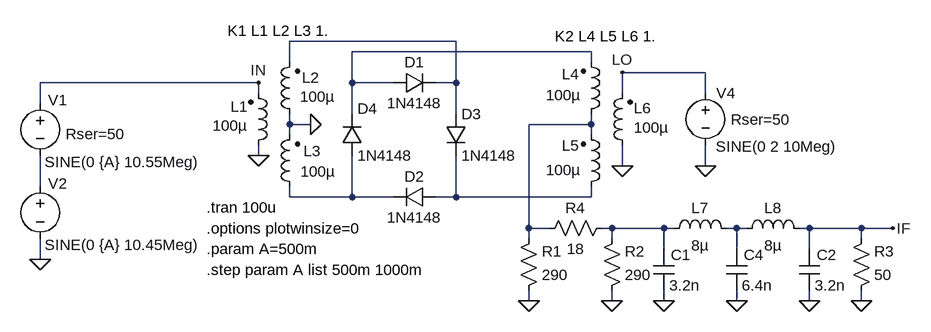
[diagram p0: schematic dbm.asc]
dbm.asc, the LTspice schematic file:
Version 4
SHEET 1 3744 2580
WIRE 1792 1920 1792 1888
WIRE 1792 2048 1792 2000
WIRE 1792 2160 1792 2128
WIRE 2128 1888 1792 1888
WIRE 2128 1904 2128 1888
WIRE 2128 2000 2128 1984
WIRE 2176 1856 2176 1824
WIRE 2176 1952 2176 1936
WIRE 2176 1968 2176 1952
WIRE 2176 2064 2176 2048
WIRE 2208 1952 2176 1952
WIRE 2272 1888 2272 1840
WIRE 2272 1936 2272 1888
WIRE 2272 2064 2176 2064
WIRE 2272 2064 2272 2000
WIRE 2336 1888 2272 1888
WIRE 2336 2064 2272 2064
WIRE 2432 1824 2176 1824
WIRE 2432 1888 2400 1888
WIRE 2432 1888 2432 1824
WIRE 2432 1936 2432 1888
WIRE 2432 2064 2400 2064
WIRE 2432 2064 2432 2000
WIRE 2544 2112 2544 1952
WIRE 2544 2128 2544 2112
WIRE 2544 2224 2544 2208
WIRE 2576 2112 2544 2112
WIRE 2640 1840 2272 1840
WIRE 2640 1856 2640 1840
WIRE 2640 1952 2544 1952
WIRE 2640 1952 2640 1936
WIRE 2640 1968 2640 1952
WIRE 2640 2064 2432 2064
WIRE 2640 2064 2640 2048
WIRE 2672 2112 2656 2112
WIRE 2672 2128 2672 2112
WIRE 2672 2224 2672 2208
WIRE 2688 1904 2688 1872
WIRE 2688 2016 2688 1984
WIRE 2752 2112 2672 2112
WIRE 2752 2144 2752 2112
WIRE 2752 2224 2752 2208
WIRE 2768 2112 2752 2112
WIRE 2816 1872 2688 1872
WIRE 2816 1904 2816 1872
WIRE 2816 2016 2816 1984
WIRE 2864 2112 2848 2112
WIRE 2864 2144 2864 2112
WIRE 2864 2224 2864 2208
WIRE 2880 2112 2864 2112
WIRE 2976 2112 2960 2112
WIRE 2976 2144 2976 2112
WIRE 2976 2224 2976 2208
WIRE 3056 2112 2976 2112
WIRE 3056 2128 3056 2112
WIRE 3056 2224 3056 2208
WIRE 3104 2112 3056 2112
FLAG 1792 2160 0
FLAG 2128 2000 0
FLAG 2208 1952 0
FLAG 2816 2016 0
FLAG 2688 2016 0
FLAG 2128 1888 IN
FLAG 2688 1872 LO
FLAG 2752 2224 0
FLAG 3104 2112 IF
FLAG 3056 2224 0
FLAG 2864 2224 0
FLAG 2976 2224 0
FLAG 2544 2224 0
FLAG 2672 2224 0
SYMBOL voltage 2816 1888 R0
WINDOW 3 16 98 Left 0
WINDOW 123 0 0 Left 0
WINDOW 39 39 57 Left 0
WINDOW 0 17 16 Left 0
SYMATTR Value SINE(0 2 10Meg)
SYMATTR SpiceLine Rser=50
SYMATTR InstName V4
SYMBOL diode 2336 1904 R270
WINDOW 0 32 32 VTop 0
WINDOW 3 0 32 VBottom 0
SYMATTR InstName D1
SYMATTR Value 1N4148
SYMBOL ind2 2624 1952 M180
WINDOW 0 -2 77 Right 0
WINDOW 3 0 45 Right 0
SYMATTR InstName L4
SYMATTR Value 100µ
SYMATTR Type ind
SYMBOL ind2 2624 2064 M180
WINDOW 0 -2 79 Right 0
WINDOW 3 0 42 Right 0
SYMATTR InstName L5
SYMATTR Value 100µ
SYMATTR Type ind
SYMBOL ind2 2704 2000 R180
WINDOW 0 -2 73 Right 0
WINDOW 3 -2 43 Right 0
SYMATTR InstName L6
SYMATTR Value 100µ
SYMATTR Type ind
SYMBOL ind2 2192 1952 R180
WINDOW 0 -3 72 Right 0
WINDOW 3 0 43 Right 0
SYMATTR InstName L2
SYMATTR Value 100µ
SYMATTR Type ind
SYMBOL ind2 2192 2064 R180
WINDOW 0 -5 71 Right 0
WINDOW 3 -1 39 Right 0
SYMATTR InstName L3
SYMATTR Value 100µ
SYMATTR Type ind
SYMBOL ind2 2112 2000 M180
WINDOW 0 0 75 Right 0
WINDOW 3 -1 46 Right 0
SYMATTR InstName L1
SYMATTR Value 100µ
SYMATTR Type ind
SYMBOL voltage 1792 1904 R0
WINDOW 3 7 106 Left 0
WINDOW 123 0 0 Left 0
WINDOW 39 39 63 Left 0
WINDOW 0 12 11 Left 0
SYMATTR Value SINE(0 {A} 10.55Meg)
SYMATTR SpiceLine Rser=50
SYMATTR InstName V1
SYMBOL diode 2400 2080 M270
WINDOW 0 32 32 VTop 0
WINDOW 3 0 32 VBottom 0
SYMATTR InstName D2
SYMATTR Value 1N4148
SYMBOL diode 2416 1936 R0
SYMATTR InstName D3
SYMATTR Value 1N4148
SYMBOL diode 2256 2000 M180
WINDOW 0 24 72 Left 0
WINDOW 3 24 0 Left 0
SYMATTR InstName D4
SYMATTR Value 1N4148
SYMBOL voltage 1792 2032 R0
WINDOW 3 7 106 Left 0
WINDOW 123 0 0 Left 0
WINDOW 39 39 63 Left 0
WINDOW 0 12 11 Left 0
SYMATTR Value SINE(0 {A} 10.45Meg)
SYMATTR InstName V2
SYMBOL ind 2752 2128 R270
WINDOW 0 32 56 VTop 0
WINDOW 3 5 56 VBottom 0
SYMATTR InstName L7
SYMATTR Value 8µ
SYMBOL res 3040 2224 M180
WINDOW 0 36 76 Left 0
WINDOW 3 36 40 Left 0
SYMATTR InstName R3
SYMATTR Value 50
SYMBOL cap 2848 2208 M180
WINDOW 0 27 55 Left 0
WINDOW 3 24 8 Left 0
SYMATTR InstName C4
SYMATTR Value 6.4n
SYMBOL ind 2864 2128 R270
WINDOW 0 32 56 VTop 0
WINDOW 3 5 56 VBottom 0
SYMATTR InstName L8
SYMATTR Value 8µ
SYMBOL cap 2960 2208 M180
WINDOW 0 27 55 Left 0
WINDOW 3 24 8 Left 0
SYMATTR InstName C2
SYMATTR Value 3.2n
SYMBOL cap 2736 2208 M180
WINDOW 0 27 55 Left 0
WINDOW 3 24 8 Left 0
SYMATTR InstName C1
SYMATTR Value 3.2n
SYMBOL res 2528 2224 M180
WINDOW 0 36 76 Left 0
WINDOW 3 36 40 Left 0
SYMATTR InstName R1
SYMATTR Value 290
SYMBOL res 2656 2224 M180
WINDOW 0 36 76 Left 0
WINDOW 3 36 40 Left 0
SYMATTR InstName R2
SYMATTR Value 290
SYMBOL res 2672 2096 R90
WINDOW 0 0 56 VBottom 0
WINDOW 3 32 56 VTop 0
SYMATTR InstName R4
SYMATTR Value 18
TEXT 2048 2080 Left 0 !.tran 100u
TEXT 2048 2112 Left 0 !.options plotwinsize=0
TEXT 2584 1816 Left 0 !K2 L4 L5 L6 1.
TEXT 2080 1808 Left 0 !K1 L1 L2 L3 1.
TEXT 2048 2176 Left 0 !.step param A list 500m 1000m
TEXT 2048 2144 Left 0 !.param A=500m

The netlist it stands for:
* dbm.asc
V4 LO 0 SINE(0 2 10Meg) Rser=50
D1 N004 N002 1N4148
L4 N006 N004 100µ
L5 N005 N006 100µ
L6 0 LO 100µ
L2 0 N002 100µ
L3 N003 0 100µ
L1 0 IN 100µ
V1 IN N001 SINE(0 {A} 10.55Meg) Rser=50
D2 N005 N003 1N4148
D3 N002 N005 1N4148
D4 N003 N004 1N4148
V2 N001 0 SINE(0 {A} 10.45Meg)
L7 N007 N008 8µ
R3 0 IF 50
C4 0 N008 6.4n
L8 N008 IF 8µ
C2 0 IF 3.2n
C1 0 N007 3.2n
R1 0 N006 290
R2 0 N007 290
R4 N007 N006 18
.model D D
.lib standard.dio
.tran 100u
.options plotwinsize=0
K2 L4 L5 L6 1.
K1 L1 L2 L3 1.
.step param A list 500m 1000m
.param A=500m
.backanno
.end